# Altium schematic sheet KEY_PLC1.SchDoc
size 420 x 297 mm; Author: Тертычный; DrawnBy: Тертычный; SheetNumber: 1; SheetTotal: 2; Scale: {Масш.}; Title1str: {Наименование}; PageSetup: Record=PageOptions|CenterHorizontal=False|CenterVertical=False|PrintScale=0.67|XCorrection=0.00|YCorrection=0.00|PrintKind=1|BorderSize=5000000|LeftOffset=0|BottomOffset=0|Orientation=2|PaperLength=2970|PaperWidth=2100|Scale=100|PaperSource=7|PrintQuality=600|MediaType=1|DitherType=10|PaperKind=A4|PrintScaleMode=1; Title2str: {Наименование}; Mass: {Масса}; Letter1Column: {}; Letter2Column: {}; Letter3Column: {}; DocumentType: Панель индикации; DocumentType1str: {Документ}; DocumentType2str: {Документ}
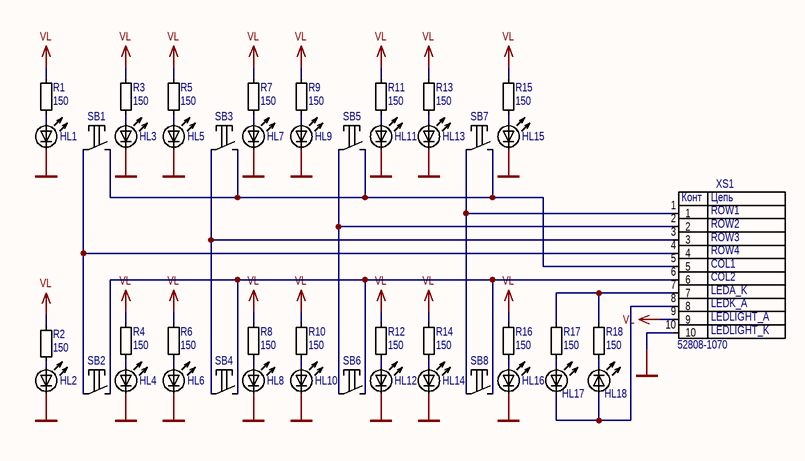
[diagram p0: KEY_PLC1.SchDoc]

## Parts
HL1  BL-LS0805UYC  [LED_0805]  (value not drawn)
HL2  BL-LS0805UYC  [LED_0805]  (value not drawn)
HL3  BL-LS0805UYC  [LED_0805]  (value not drawn)
HL4  BL-LS0805UYC  [LED_0805]  (value not drawn)
HL5  BL-LS0805UYC  [LED_0805]  (value not drawn)
HL6  BL-LS0805UYC  [LED_0805]  (value not drawn)
HL7  BL-LS0805UYC  [LED_0805]  (value not drawn)
HL8  BL-LS0805UYC  [LED_0805]  (value not drawn)
HL9  BL-LS0805UYC  [LED_0805]  (value not drawn)
HL10  BL-LS0805UYC  [LED_0805]  (value not drawn)
HL11  BL-LS0805UYC  [LED_0805]  (value not drawn)
HL12  BL-LS0805UYC  [LED_0805]  (value not drawn)
HL13  BL-LS0805UYC  [LED_0805]  (value not drawn)
HL14  BL-LS0805UYC  [LED_0805]  (value not drawn)
HL15  BL-LS0805UYC  [LED_0805]  (value not drawn)
HL16  BL-LS0805UYC  [LED_0805]  (value not drawn)
HL17  BL-LS0805PGC  [LED_0805G]  (value not drawn)
HL18  BL-LS0805UHR  [LED_0805R]  (value not drawn)
R1  150  [RES_0603]
R2  150  [RES_0603]
R3  150  [RES_0603]
R4  150  [RES_0603]
R5  150  [RES_0603]
R6  150  [RES_0603]
R7  150  [RES_0603]
R8  150  [RES_0603]
R9  150  [RES_0603]
R10  150  [RES_0603]
R11  150  [RES_0603]
R12  150  [RES_0603]
R13  150  [RES_0603]
R14  150  [RES_0603]
R15  150  [RES_0603]
R16  150  [RES_0603]
R17  150  [RES_0603]
R18  150  [RES_0603]
SB1  1181  [1181]  (value not drawn)
SB2  1181  [1181]  (value not drawn)
SB3  1181  [1181]  (value not drawn)
SB4  1181  [1181]  (value not drawn)
SB5  1181  [1181]  (value not drawn)
SB6  1181  [1181]  (value not drawn)
SB7  1181  [1181]  (value not drawn)
SB8  1181  [1181]  (value not drawn)
XS1  52808-1070  [52808-1070]

## Nets
GND: HL1.1 HL2.1 HL3.1 HL4.1 HL5.1 HL6.1 HL7.1 HL8.1 HL9.1 HL10.1 HL11.1 HL12.1 HL13.1 HL14.1 HL15.1 HL16.1 XS1.10
VL: R1.2 R2.2 R3.2 R4.2 R5.2 R6.2 R7.2 R8.2 R9.2 R10.2 R11.2 R12.2 R13.2 R14.2 R15.2 R16.2 XS1.9
NetHL1_2: HL1.2 R1.1
NetHL2_2: HL2.2 R2.1
NetHL3_2: HL3.2 R3.1
NetHL4_2: HL4.2 R4.1
NetHL5_2: HL5.2 R5.1
NetHL6_2: HL6.2 R6.1
NetHL7_2: HL7.2 R7.1
NetHL8_2: HL8.2 R8.1
NetHL9_2: HL9.2 R9.1
NetHL10_2: HL10.2 R10.1
NetHL11_2: HL11.2 R11.1
NetHL12_2: HL12.2 R12.1
NetHL13_2: HL13.2 R13.1
NetHL14_2: HL14.2 R14.1
NetHL15_2: HL15.2 R15.1
NetHL16_2: HL16.2 R16.1
NetHL17_1: HL17.1 HL18.2 XS1.8
NetHL17_2: HL17.2 R17.1
NetHL18_1: HL18.1 R18.1
NetR17_2: R17.2 R18.2 XS1.7
NetSB1_1: SB1.1 SB2.1 XS1.4
NetSB1_2: SB1.2 SB3.2 SB5.2 SB7.2 XS1.5
NetSB2_2: SB2.2 SB4.2 SB6.2 SB8.2 XS1.6
NetSB3_1: SB3.1 SB4.1 XS1.3
NetSB5_1: SB5.1 SB6.1 XS1.2
NetSB7_1: SB7.1 SB8.1 XS1.1

## Notes on the sheet
- (near XS1) ROW1
- (near XS1) ROW2
- (near XS1) ROW3
- (near XS1) ROW4
- (near XS1) COL1
- (near XS1) COL2
- (near XS1) LEDA_K
- (near XS1) LEDK_A
- (near XS1) LEDLIGHT_A
- (near XS1) LEDLIGHT_K
- Перв. примен.
- Справ. №
- Подп. и дата
- Инв. № дубл.
- Взам. инв. №
- Разраб.
- Изм.
- Лист
- № докум.
- Подп.
- Дата
- Лит.
- Масса
- Масштаб
- Пров.
- Т.контр.
- Листов
- Инв. № подл.
- Утв.
- Н.контр.
- 2.106-A3
- Копировал
- Формат А3
- (in symbol 52808-1070) Конт; Цепь

## Library data of the parts
HL18 = BL-LS0805UHR: Manufacturer: Betlux; Distributor: http://www.chipdip.ru/; Part Number: BL-LS0805UHR; PackageReference: 0805
R1-R18 = Res_0603: 0603, 150; Manufacturer: YAGEO; Part Number: RC0603FR-07150RL; Replacement: 0603 150 5%; PackageReference: 0603; Value: 150; Price: 0.004$
SB1-SB8 = 1181: IT-1181-180G-G; Part Number: IT-1181-180G-G; PackageReference: SMT
XS1 = 52808-1070: MOLEX 10-way connector; Part Number: 52808-1070; PackageReference: SMT; Manufacturer: Molex
HL1-HL16 = BL-LS0805UYC: Part Number: BL-LS0805UYC; PackageReference: 0805
HL17 = BL-LS0805PGC: Part Number: BL-LS0805PGC; PackageReference: 0805